# EasyEDA Pro project ESP32_Wroom.eprj, board PCB1
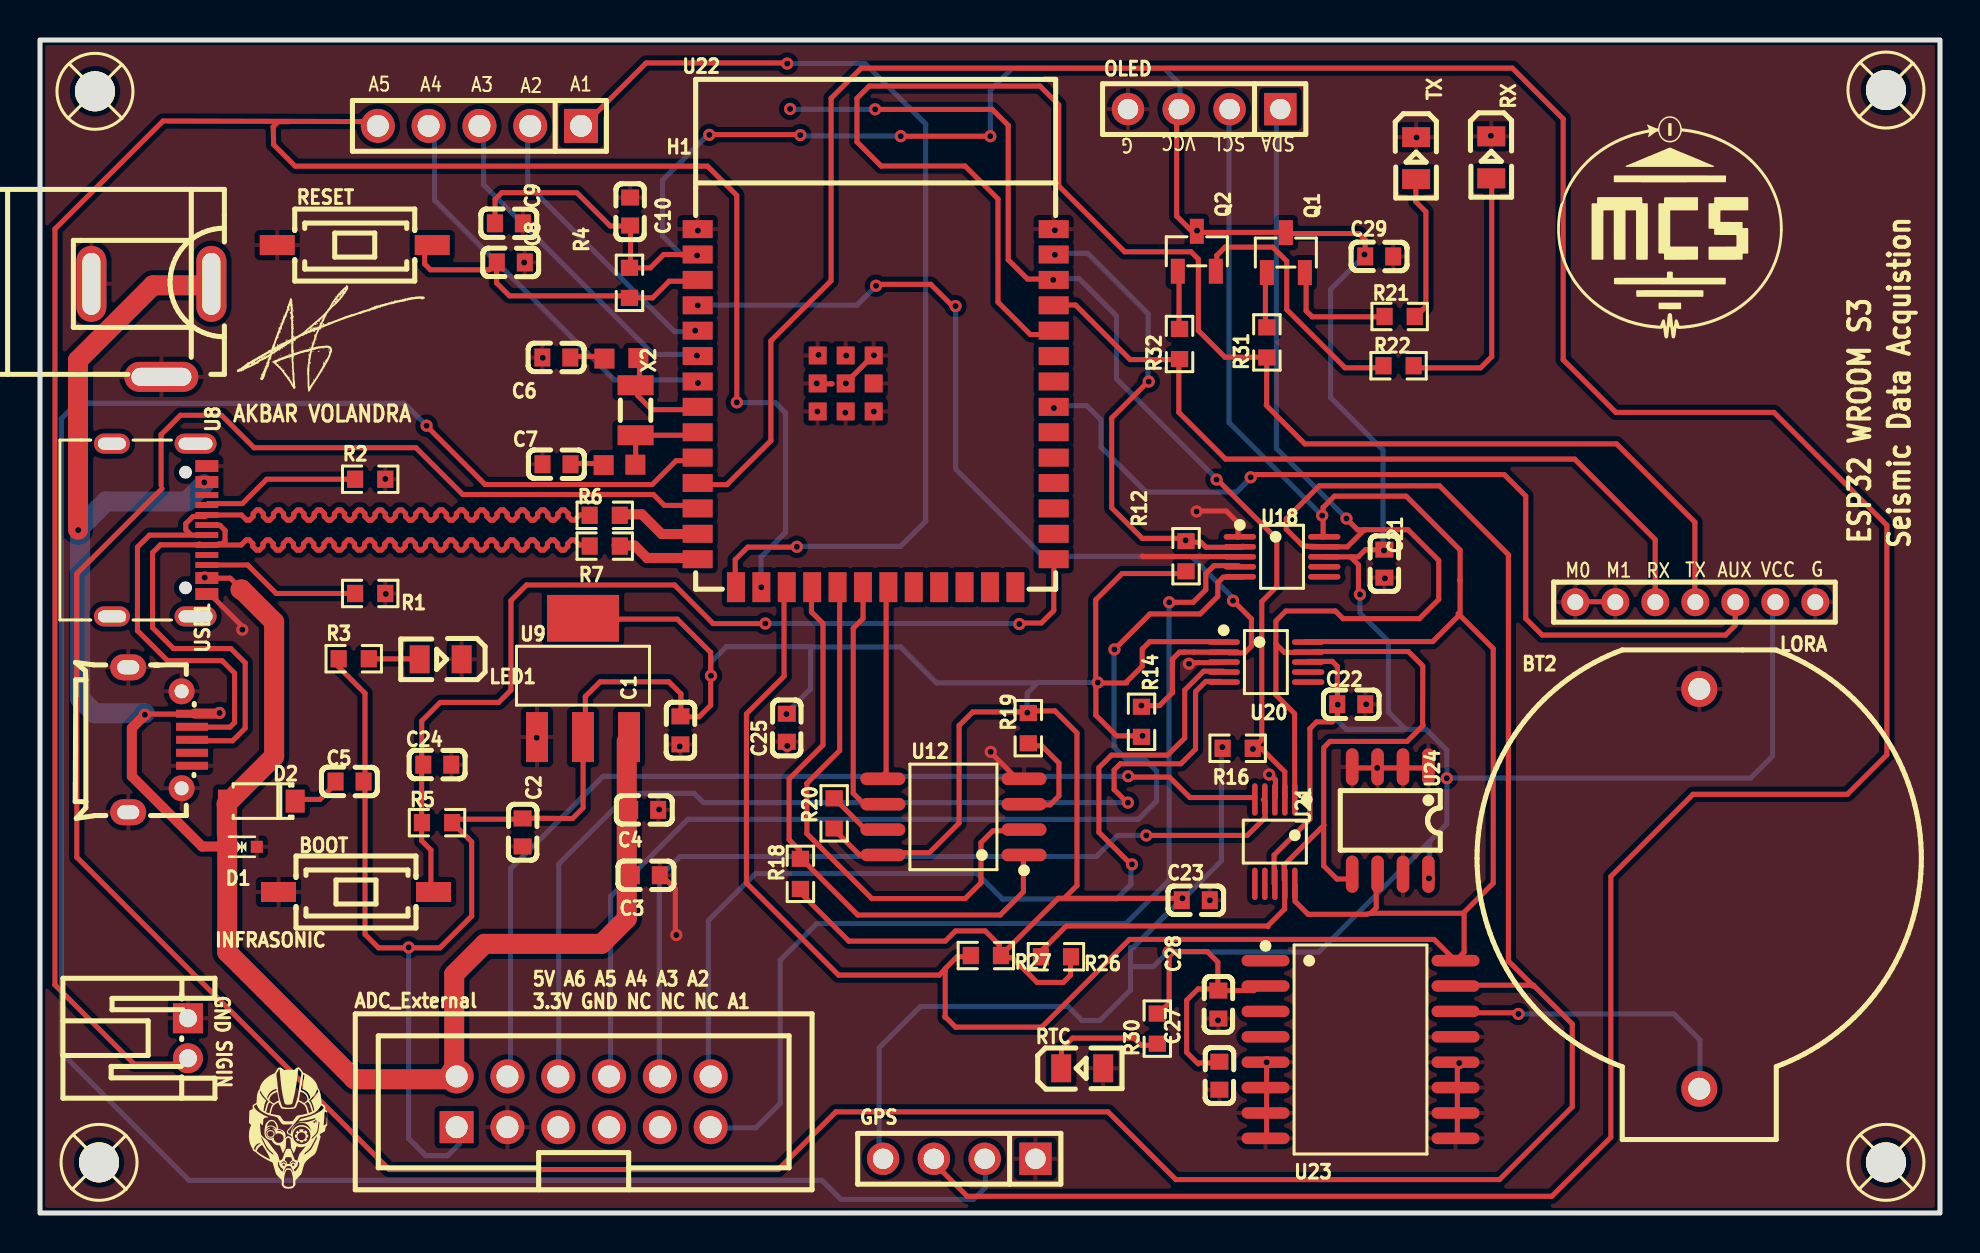
[diagram p3: board, top side]
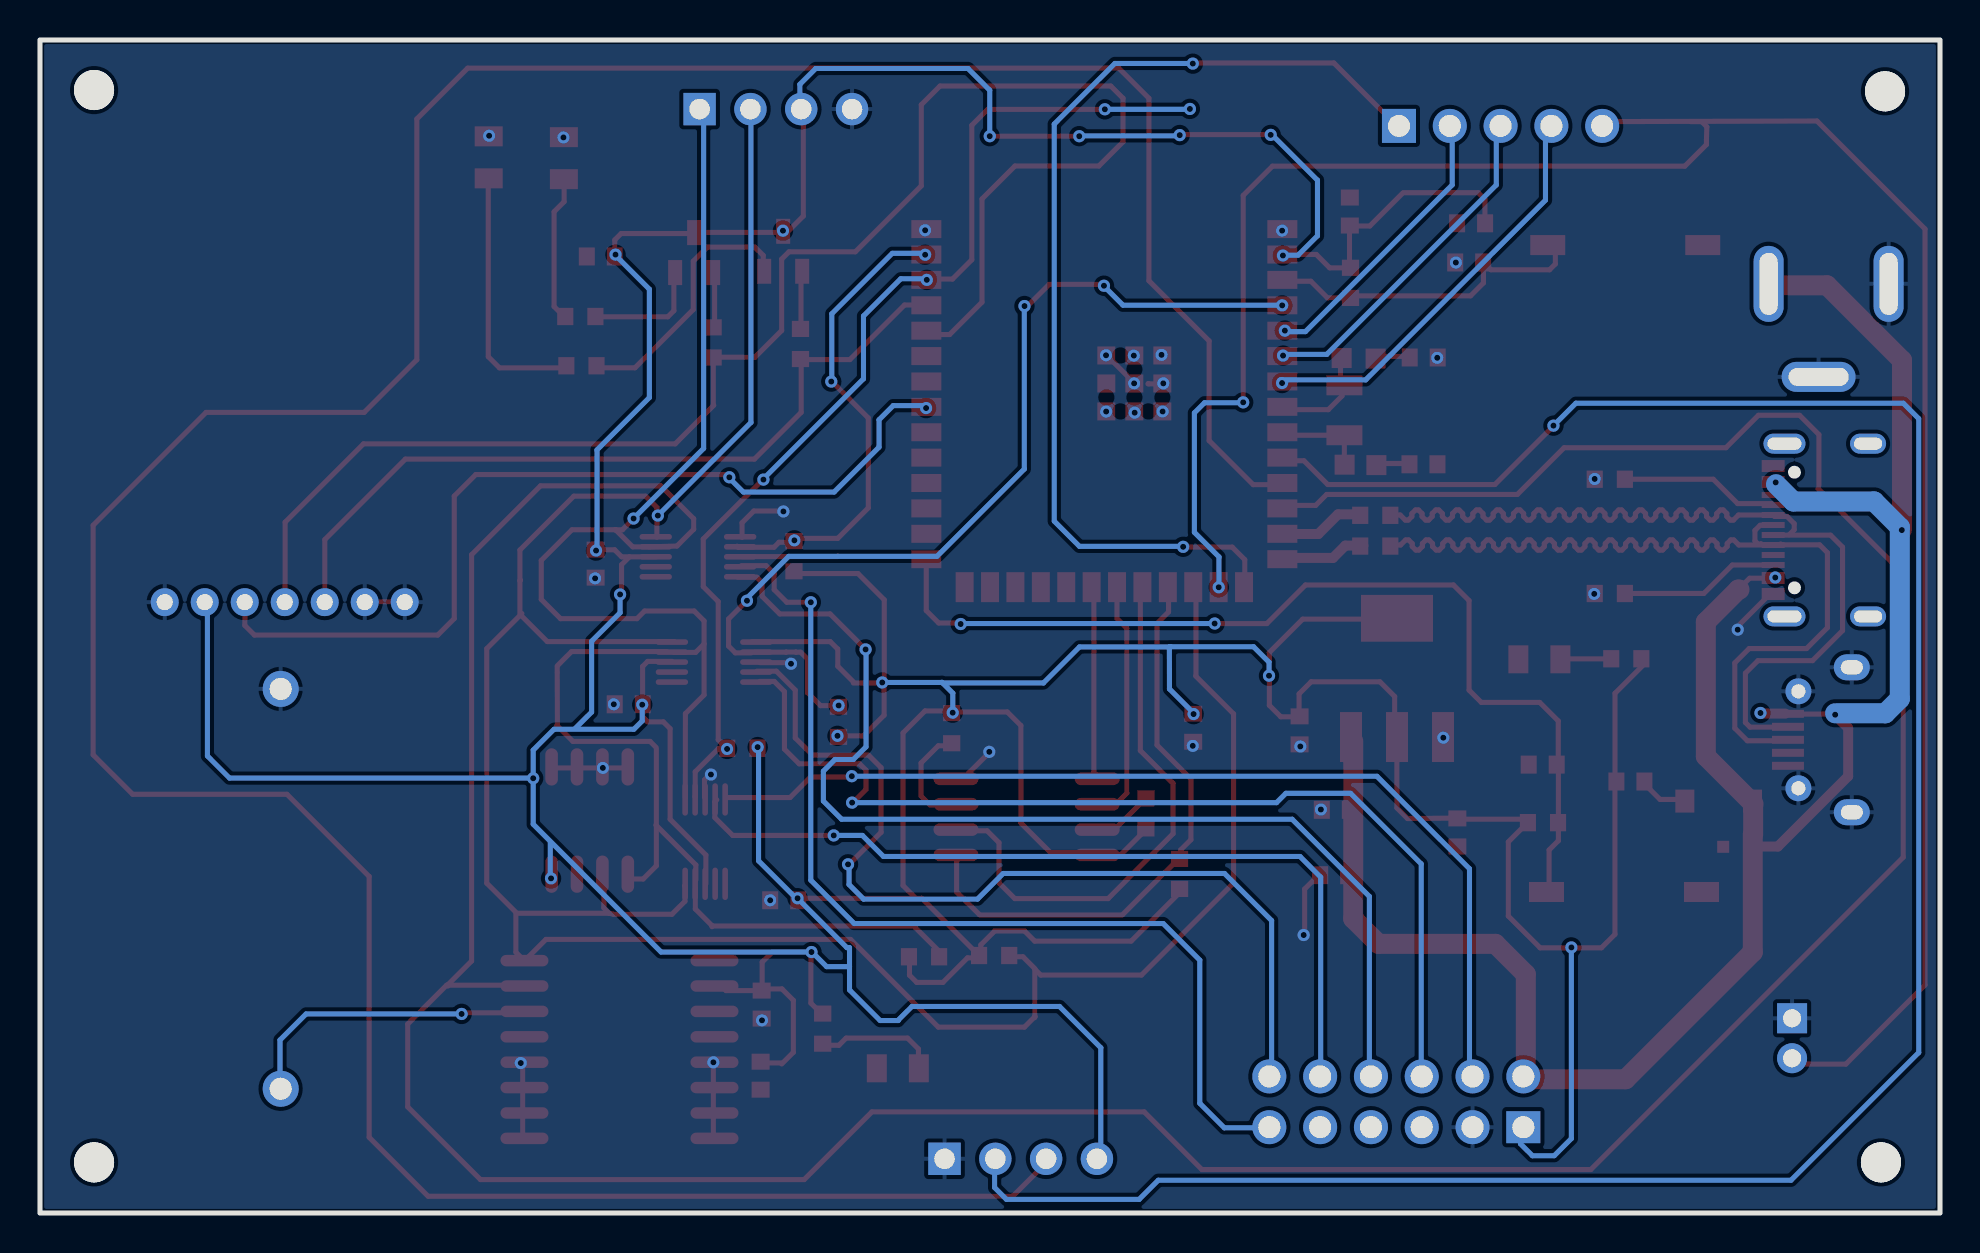
[diagram p4: board, bottom side, seen from below]

Outline 95 x 58.67 mm; copper layers: Top Layer, Bottom Layer. Coordinates in mm from the lower left corner of the outline.
Outline path: rectangle 0,58.67 95,0
Stack: Top Layer 0.035mm / Dielectric1 1.51mm FR4 er 4.5 / Bottom Layer 0.035mm

## Design rules (mm)
net D-: DP1
net D+: DP1
template: JLCPCB Capability(Two Layers Board)
spacing copperThickness1oz (default): track to track 0.102, other pairs 0.152 to 0.3
spacing copperThickness2oz: track to track 0.203, other pairs 0.152 to 0.3
track width copperThickness1oz (default): min 0.127, default 0.254, max 2.54
track width copperThickness2oz: min 0.203, default 0.254, max 2.54
differential pair differentialPair (default): width min 0.127, default 0.254, max 2.54; gap min 0.152, default 0.152
via viaSize (default): diameter min 0.5, default 0.61, max 10; hole min 0.3, default 0.305, max 6.3

## Placement (name value [footprint] x y rotation side)
ADC_External  T821112A1R100CEU  [IDC-TH_12P-P2.54_BOOMELE-2X6P-2.54MM]  27.18 5.56 0 top
BOOT  HX-3x6x2.5-X SMD tact Switch  [SW-SMD_HX-3X6X2.5-X]  15.8 16.06 0 top
BT2  XDBS-CR2032-9  [BAT-TH_XDBS-CR2032-9]  82.97 16.21 270 top
C1  10uF  [C0603]  32.02 24.14 270 top
C2  100nF  [C0603]  24.13 19.04 270 top
C3  10uF  [C0603]  30.29 16.9 180 top
C4  100nF  [C0603]  30.21 20.17 180 top
C5  10uF  [C0603]  15.48 21.58 0 top
C6  12pF  [C0603]  25.81 42.79 0 top
C7  12pF  [C0603]  25.83 37.45 0 top
C8  100nF  [C0603]  23.54 47.55 0 top
C9  22uF  [C0603]  23.45 49.5 0 top
C10  100nF  [C0603]  29.51 50.09 90 top
C21  1uF  [C0603]  67.22 32.48 270 top
C22  1uF  [C0603]  65.56 25.45 0 top
C23  1uF  [C0603]  57.79 15.64 0 top
C24  100nF  [C0603]  19.87 22.43 0 top
C25  100nF  [C0603]  37.34 24.27 90 top
C27  100nF  [C0603]  58.97 6.87 270 top
C28  100nF  [C0603]  58.92 10.43 270 top
C29  100nF  [C0603]  66.96 47.85 0 top
D1  LESD5D5.0CT1G  [SOD-523_L1.2-W0.8-LS1.6-BI]  10.09 18.32 0 top
D2  MBR0560  [SOD-123_L2.8-W1.8-LS3.7-RD]  11.07 20.6 180 top
GPS  HX PH254-01-04-Z-L11.5 straight pin header  [HDR-TH_4P-HX-PH254-01-04-Z-L11.5]  45.96 2.71 180 top
H1  2.54-1*5  [HDR-TH_5P-P2.54-V-M]  21.97 54.38 180 top
INFRASONIC  S2B-PH-K(LF)(SN)  [CONN-TH_S2B-PH-K-LF-SN]  7.4 8.74 90 top
LED1  KT-0805G  [LED0805-R-RD]  20.03 27.69 180 top
LORA  KH-2PH180-1X7P-L8.7  [CONN-TH_KH-2PH180-1X7P-L8.7]  82.76 30.55 0 top
NOREF  -  [Pad_e227]  28.18 37.41 0 top
NOREF#2  -  [Pad_e226]  29.92 42.76 0 top
NOREF#3  -  [Pad_e224]  28.22 42.74 0 top
NOREF#4  -  [Pad_e228]  29.77 37.43 0 top
OLED  HX PH254-01-04-Z-L11.5 straight pin header  [HDR-TH_4P-HX-PH254-01-04-Z-L11.5]  58.21 55.22 180 top
Q1  SS8050  [SOT-23-3_L2.9-W1.3-P1.90-LS2.4-BR]  62.29 48.04 270 top
Q2  SS8050  [SOT-23-3_L2.9-W1.3-P1.90-LS2.4-BR]  57.84 48.11 270 top
R1  5k1  [R0603]  16.51 30.99 180 top
R2  5k1  [R0603]  16.51 36.7 0 top
R3  330  [R0603]  15.69 27.72 0 top
R4  10K  [R0603]  29.47 46.53 270 top
R5  10K  [R0603]  19.85 19.52 0 top
R6  22  [R0603]  28.24 34.9 180 top
R7  22  [R0603]  28.24 33.36 180 top
R12  10K  [R0603]  57.3 32.85 270 top
R14  10K  [R0603]  55.08 24.57 270 top
R16  10K  [R0603]  59.88 23.25 180 top
R18  10K  [R0603]  38.02 16.96 90 top
R19  10K  [R0603]  49.42 24.25 270 top
R20  10K  [R0603]  39.71 19.99 270 top
R21  330  [R0603]  67.98 44.84 0 top
R22  330  [R0603]  67.93 42.38 0 top
R26  4.7K  [R0603]  50.8 12.82 180 top
R27  4.7K  [R0603]  47.29 12.88 180 top
R30  1k  [R0603]  55.87 9.22 90 top
R31  2.2k  [R0603]  61.34 43.55 90 top
R32  2.2k  [R0603]  56.98 43.47 90 top
RESET  HX-3x6x2.5-X SMD tact Switch  [SW-SMD_HX-3X6X2.5-X]  15.74 48.42 0 top
RTC  KT-0805G  [LED0805-R-RD]  52.11 7.24 0 top
RX  KT-0805G  [LED0805-R-RD]  72.56 52.8 270 top
SCREW1  -  [Screw-Hole-M2]  2.75 56.11 0 top
SCREW2  -  [Screw-Hole-M2]  92.3 56.17 0 top
SCREW3  -  [Screw-Hole-M2]  92.3 2.53 0 top
SCREW4  -  [Screw-Hole-M2]  2.95 2.53 0 top
TX  KT-0805G  [LED0805-R-RD]  68.81 52.76 270 top
U8  TYPE C-ZL-104PWB  [TYPE-C-SMD_HDGC_TYPE-C-ZL-104PWB]  5.97 34.16 270 top
U9  AMS1117-3.3  [SOT-223-3_L6.5-W3.4-P2.30-LS7.0-BR]  27.15 26.78 270 top
U12  W25Q128JVSIQ  [SOIC-8_L5.3-W5.3-P1.27-LS8.0-BL]  45.67 19.81 90 top
U18  ADS1115IDGSR  [MSOP-10_L3.0-W3.0-P0.50-LS5.0-BL]  62.1 32.82 270 top
U19  POWER-JACK  [DC-IN-TH_POWER-JACK]  5.57 44.15 0 top
U20  ADS1115IDGSR  [MSOP-10_L3.0-W3.0-P0.50-LS5.0-BL]  61.29 27.56 270 top
U21  ADS1115IDGSR  [MSOP-10_L3.0-W3.0-P0.50-LS5.0-BL]  61.74 18.58 180 top
U22  2.4GHz  [WIFIM-SMD_ESP32-S3-WROOM-1-N8]  41.78 40.26 0 top
U23  DS3231  [SOIC-16_L10.3-W7.5-P1.27-LS10.3-BL]  66.03 8.18 270 top
U24  AT24C32CDR165  [SOP-8_L4.9-W3.9-P1.27-LS6.0-BL]  67.51 19.63 180 top
USB1  MicroXNJ  [MICRO-USB-SMD_MICROXNJ]  6.01 23.67 270 top
X2  32.768kHz  [FC-135R_L3.2-W1.5]  29.78 40.15 270 top

## Footprints (pads in the part's own frame, mm; a bottom-side part is the same pattern mirrored in y, then rotated)
BAT-TH_XDBS-CR2032-9
  round 1.8 hole 1.1: 1(10,0) 2(-10,0)
C0603
  rect 0.8x0.9 smd: 1(-0.7,0) 2(0.7,0)
CONN-TH_KH-2PH180-1X7P-L8.7
  round 1.4 hole 0.8: 1(-6,0) 2(-4,0) 3(-2,0) 4(0,0) 5(2,0) 6(4,0) 7(6,0)
CONN-TH_S2B-PH-K-LF-SN
  rect 1.5x1.5 hole 0.9: 1(1,0)
  round 1.5 hole 0.9: 2(-1,0)
DC-IN-TH_POWER-JACK
  oval 1.5x3.8 hole 0.9x3.1: 1(2.999,2.325) 2(-2.999,2.325)
  oval 3.7x1.5 hole 3x0.9: 3(0.5,-2.325)
FC-135R_L3.2-W1.5
  rect 1x1.8 smd: 1(-1.25,0) 2(1.25,0)
HDR-TH_4P-HX-PH254-01-04-Z-L11.5
  rect 1.62x1.62 hole 1.02: 1(-3.81,0)
  round 1.62 hole 1.02: 2(-1.27,0) 3(1.27,0) 4(3.81,0)
HDR-TH_5P-P2.54-V-M
  rect 1.7x1.7 hole 1.1: 1(-5.08,0)
  round 1.7 hole 1.1: 2(-2.54,0) 3(0,0) 4(2.54,0) 5(5.08,0)
IDC-TH_12P-P2.54_BOOMELE-2X6P-2.54MM
  rect 1.7x1.6 hole 1.1: 1(-6.35,-1.27)
  round 1.7 hole 1.1: 2(-6.35,1.27) 3(-3.81,-1.27) 4(-3.81,1.27) 5(-1.27,-1.27) 6(-1.27,1.27) 7(1.27,-1.27) 8(1.27,1.27) 9(3.81,-1.27) 10(3.81,1.27) 11(6.35,-1.27) 12(6.35,1.27)
LED0805-R-RD
  rect 1x1.399 smd: 1(1.05,0) 2(-1.05,0)
MICRO-USB-SMD_MICROXNJ
  rect 0.4x1.6 smd: 1(-1.3,1.597) 2(-0.65,1.597) 3(0,1.597) 4(0.65,1.597) 5(1.3,1.597)
  round 1.3 hole 0.7: 6(2.425,1.074) 9(-2.425,1.073)
  oval 1.3x1.8 hole 0.7x1.1: 7(3.625,-1.597) 8(-3.625,-1.597)
MSOP-10_L3.0-W3.0-P0.50-LS5.0-BL
  oval 0.28x1.62 smd: 1(-1,-2.11) 2(-0.5,-2.11) 3(0,-2.11) 4(0.5,-2.11) 5(1,-2.11) 6(1,2.11) 7(0.5,2.11) 8(0,2.11) 9(-0.5,2.11) 10(-1,2.11)
Pad_e224
  rect 1x1 smd: 1(0,0)
Pad_e226
  rect 1x1 smd: 1(0,0)
Pad_e227
  rect 1x1 smd: 1(0,0)
Pad_e228
  rect 1x1 smd: 1(0,0)
R0603
  rect 0.806x0.864 smd: 1(-0.753,0) 2(0.753,0)
Screw-Hole-M2
  round 2 hole 2: 1(0,0)
SOD-123_L2.8-W1.8-LS3.7-RD
  rect 0.95x1.15 smd: 1(-1.692,0) 2(1.692,0)
SOD-523_L1.2-W0.8-LS1.6-BI
  rect 0.6x0.6 smd: 1(-0.75,0) 2(0.75,0)
SOIC-8_L5.3-W5.3-P1.27-LS8.0-BL
  oval 0.63x2.25 smd: 1(-1.905,-3.53) 2(-0.635,-3.53) 3(0.635,-3.53) 4(1.905,-3.53) 5(1.905,3.53) 6(0.635,3.53) 7(-0.635,3.53) 8(-1.905,3.53)
SOIC-16_L10.3-W7.5-P1.27-LS10.3-BL
  oval 0.574x2.401 smd: 1(-4.445,-4.75) 2(-3.175,-4.75) 3(-1.905,-4.75) 4(-0.635,-4.75) 5(0.635,-4.75) 6(1.905,-4.75) 7(3.175,-4.75) 8(4.445,-4.75) 9(4.445,4.75) 10(3.175,4.75) 11(1.905,4.75) 12(0.635,4.75) 13(-0.635,4.75) 14(-1.905,4.75) 15(-3.175,4.75) 16(-4.445,4.75)
SOP-8_L4.9-W3.9-P1.27-LS6.0-BL
  oval 0.63x1.865 smd: 1(-1.905,-2.683) 2(-0.635,-2.683) 3(0.635,-2.683) 4(1.905,-2.683) 5(1.905,2.683) 6(0.635,2.683) 7(-0.635,2.683) 8(-1.905,2.683)
SOT-23-3_L2.9-W1.3-P1.90-LS2.4-BR
  rect 1.25x0.7 smd: 1(1,-0.95) 2(1,0.95) 3(-1,0)
SOT-223-3_L6.5-W3.4-P2.30-LS7.0-BR
  rect 2.5x1.1 smd: 1(2.97,-2.3) 2(2.97,0) 3(2.97,2.3)
  rect 2.34x3.6 smd: 4(-2.97,0)
SW-SMD_HX-3X6X2.5-X
  rect 1.75x1 smd: 1(-3.875,0) 2(3.875,0)
TYPE-C-SMD_HDGC_TYPE-C-ZL-104PWB
  oval 1x2.1 hole 0.6x1.7: 12(-4.32,1.808) 13(4.32,1.808)
  oval 1x1.8 hole 0.6x1.4: 14(-4.32,-2.373) 15(4.32,-2.373)
  rect 0.6x1.15 smd: A1B12(-3.2,2.373) A4B9(-2.4,2.373) A9B4(2.4,2.373) A12B1(3.2,2.373)
  rect 0.3x1.15 smd: A5(-1.25,2.373) A6(-0.25,2.373) A7(0.25,2.373) A8(1.25,2.373) B5(1.75,2.373) B6(0.75,2.373) B7(-0.75,2.373) B8(-1.75,2.373)
WIFIM-SMD_ESP32-S3-WROOM-1-N8
  rect 1.5x0.9 smd: 1(-8.9,8.954) 2(-8.9,7.684) 3(-8.9,6.415) 4(-8.9,5.144) 5(-8.9,3.874) 6(-8.9,2.604) 7(-8.9,1.335) 8(-8.9,0.065) 9(-8.9,-1.206) 10(-8.9,-2.475) 11(-8.9,-3.745) 12(-8.9,-5.016) 13(-8.9,-6.285) 14(-8.9,-7.556) 27(8.9,-7.556) 28(8.9,-6.285) 29(8.9,-5.016) 30(8.9,-3.745) 31(8.9,-2.475) 32(8.9,-1.206) 33(8.9,0.065) 34(8.9,1.335) 35(8.9,2.604) 36(8.9,3.874) 37(8.9,5.144) 38(8.9,6.415) 39(8.9,7.684) 40(8.9,8.954)
  rect 0.9x1.5 smd: 15(-6.985,-8.954) 16(-5.715,-8.954) 17(-4.445,-8.954) 18(-3.175,-8.954) 19(-1.905,-8.954) 20(-0.635,-8.954) 21(0.635,-8.954) 22(1.905,-8.954) 23(3.175,-8.954) 24(4.445,-8.954) 25(5.715,-8.954) 26(6.985,-8.954)
  rect 0.9x0.9 smd: 41(-2.9,2.635) 41(-2.9,1.235) 41(-2.9,-0.165) 41(-1.5,2.635) 41(-1.5,1.235) 41(-1.5,-0.165) 41(-0.1,2.635) 41(-0.1,1.235) 41(-0.1,-0.165)

## Nets
As in the schematic, except:
RX: LORA.4 R31.1 U22.36
TX: LORA.3 R32.1 U22.37
XTALN: C7.2 NOREF.1 NOREF#4.1 U22.9 X2.2
XTALP: C6.2 NOREF#2.1 NOREF#3.1 U22.8 X2.1

Pads without a net: ADC_External 5 7 9; SCREW1 1; SCREW2 1; SCREW3 1; SCREW4 1; U8 12 13 14 15 A8 B8; U18 6 7; U20 6 7; U21 6 7; U22 22 23 24 25 26 32; U23 1 3 4; USB1 4

## Via types
v1: diameter 0.61, hole 0.305, Top Layer to Bottom Layer, 93 vias

## Routing (per net, layer and track width the routed paths; a pad name or vN(x,y) marks a point on that pad's centre or on a via; arc(x,y) is an arc through that point)
3.3V: length 384.2
  Top Layer w0.254: 52.92,26.51 54.33,26.51 ; 29.5,49.37 28.51,49.37 26.86,51.02 ; 59.39,28.58 55.49,28.58 55.12,28.21 ; 42.06,18.02 44.47,18.02 45.96,19.51 45.96,24.38 46.63,25.06 49.39,25.06 ; 20.78,19.37 21.58,18.56 21.58,14.85 20,13.26 18.46,13.26 ; 47.96,12.68 47.96,13.41 47.26,14.11 45.77,14.11 45.26,13.6 40.44,13.6 38.12,15.92 ; 16.25,21.31 16.25,13.94 16.93,13.26 18.46,13.26 ; 58.89,11.08 58.89,11.12 ; 58.89,11.12 58.87,11.12 ; 58.89,11.12 60.7,11.12 60.97,11.39 ; 32.6,47.95 31.19,47.95 30.52,47.28 29.61,47.28 29.59,47.25 ; 56.38,13.08 58.36,13.08 58.89,12.55 58.89,11.21 ; 32.03,24.82 32.96,24.82 33.53,25.39 33.53,26.55 ; 65.92,31.02 65.92,32.43 65.53,32.82 65.91,32.82 66.27,33.17 67.28,33.17 ; 48.04,12.87 50.91,15.74 57.05,15.74 ; 55.88,9.92 56.46,10.5 56.46,12.97 ; 27.27,24.33 27.27,25.83 28,26.57 31.44,26.57 32.05,25.97 32.05,24.88 ; 29.53,49.37 29.53,47.46 ; 24.14,19.73 24.11,19.7 ; 52.79,26.64 52.79,30.67 54.1,31.99 57.32,31.99 ; 41.87,17.91 40.98,17.91 39.83,19.06 ; 56.83,55.11 56.83,49.87 57.65,49.05 62.23,49.05 ; 33.53,26.87 33.53,28.04 31.87,29.7 27.29,29.7 ; 47.68,53.82 47.64,53.86 43.12,53.86 ; 63.4,27.59 64.62,27.59 64.87,27.34 64.87,24.82 64.62,24.57 63.83,24.57 63.49,24.23 63.49,19.69 61.71,17.91 61.71,16.47 ; 18.46,13.26 18.55,13.35 ; 51.21,15.75 51.85,16.38 51.85,24.01 50.75,25.11 49.47,25.11 ; 66.26,47.96 66.26,48.67 65.94,48.99 62.28,48.99 ; 16.25,21.62 16.25,26 14.74,27.5 ; 58.87,11.21 57.9,11.21 57.33,10.64 57.33,8.04 57.91,7.45 ; 54.98,23.87 53.82,23.87 52.79,24.9 52.79,26.38 ; 51.53,12.76 51.53,11.9 51.16,11.53 49.85,11.53 48.63,12.76 47.99,12.76 ; 33.39,53.94 38,53.94 38.01,53.93 ; 24.03,19.7 20.66,19.7 20.49,19.53 ; 26.82,51.04 23.09,51.04 22.75,50.7 22.75,49.4 ; 64.2,32.82 65.52,32.82 ; 54.33,26.57 55.11,27.35 55.11,28.22 ; 24.14,19.75 26.62,19.73 27.16,20.26 27.16,23.89 ; 58.97,7.51 57.91,7.51
  Bottom Layer w0.254: 47.35,53.9 47.51,54.07 47.51,56.16 48.6,57.25 56.21,57.25 57.01,56.45 57.01,55.28 ; 59.07,23.21 59.07,17.62 57.16,15.71 ; 49.87,26.51 49.36,26 49.36,25.07 ; 49.87,26.51 44.83,26.51 43.03,28.31 38.53,28.31 ; 49.87,26.51 49.89,26.54 ; 54.52,12.32 55.67,12.32 56.35,13 ; 54.52,12.32 54.52,13.27 54.65,13.27 v1(57.12,15.74) ; 54.52,12.32 54.52,11.16 52.99,9.63 52.09,9.63 52.09,9.64 51.4,10.33 44.03,10.33 41.96,8.27 41.96,2.97 ; 38.47,28.32 38.52,28.32 38.53,28.31 ; 38.47,28.32 34.32,28.32 33.55,27.55 33.55,26.95 ; 38.47,28.32 38.48,28.31 38.53,28.31 ; 49.89,26.54 49.9,26.55 ; 49.89,26.54 v1(52.89,26.54) ; 38.53,28.31 38.53,26.22 38.53,26.21 37.26,24.94 ; 38.01,53.88 42.97,53.88 43,53.9 ; 33.38,53.91 31.13,51.66 31.13,48.88 32.09,47.91 32.78,47.91 ; 69.49,18.54 69.49,16.79 69.5,16.77 ; v1(66,30.94) 66,30.02 67.42,28.6 67.42,25.05 68.23,24.24 ; 86.63,30.31 86.63,22.86 85.52,21.75 70.44,21.75 70.43,21.76 ; v1(64.89,25.43) 64.89,24.61 65.31,24.2 69.3,24.2 70.34,23.15 v1(70.34,21.75) 70.34,19.45 63.94,13.05 v1(56.43,13.05) ; 66.24,47.92 64.53,46.21 64.53,40.79 67.15,38.17 67.15,33.13 ; 20.8,4.31 20.98,4.13 20.98,3.46 20.38,2.87 19.29,2.87 18.43,3.72 v1(18.43,13.28)
  vias: v1(32.85,47.89) v1(33.47,53.93) v1(33.55,26.88) v1(37.32,24.96) v1(38.01,53.92) v1(43.04,53.86) v1(47.51,53.86) v1(49.37,25.03) v1(55.13,23.87) v1(57.85,49.14) v1(59.12,23.3) v1(66.22,47.94) v1(67.2,33.13) v1(69.45,16.74)
GND: length 35
  Top Layer w0.254: 40.25,41.53 40.44,41.71 40.48,41.71 41.49,42.73 41.56,42.73 ; 59,27.53 57.45,27.53 ; 61.54,21.9 61.77,21.66 61.77,20.79 ; 69.33,22.3 69.29,22.26 v1(66.86,22.26) 65.6,22.26 ; 70.84,3.74 70.87,3.76 70.87,7.51 ; 49.2,21.7 48.87,21.7 47.5,23.07 ; 55.11,32.87 55.15,32.83 59.9,32.83 ; 57.72,35.14 57.75,35.11 59.31,35.11 59.9,34.53 59.9,33.79 ; 39.56,41.47 39.58,41.49 ; 10.23,29.14 10.23,29.23 8.4,31.05 ; 78.65,30.52 78.6,30.57 76.81,30.57 ; 30.78,16.7 31.28,16.7 31.77,16.21 31.77,13.99 ; 38.83,41.47 39.6,41.47 ; 61.22,3.68 61.33,3.79 v1(61.33,7.54)
  vias: v1(10.11,29.18) v1(17.27,36.72) v1(17.29,30.97) v1(24.21,47.54) v1(24.83,23.77) v1(25.14,42.78) v1(30.96,20.18) v1(31.82,13.91) v1(31.98,23.34) v1(32.89,49.14) v1(37.36,23.37) v1(38.84,41.5) v1(38.87,40.09) v1(38.92,42.92) v1(40.27,40.03) v1(40.31,42.89) v1(40.29,41.5) v1(41.7,42.9) v1(41.69,40.09) v1(47.54,23.07) v1(50.74,49.16) v1(57.45,27.47) v1(57.83,35.09) v1(58.49,15.64) v1(58.9,9.64) v1(61.45,21.93) v1(66.31,25.45) v1(67.25,31.75) v1(68.83,53.8) v1(70.96,7.5) v1(72.54,53.88)
VBUS: length 108.2
  Top Layer w0.254: 8.15,31.75 9.5,31.75 ; 9.52,31.75 10.09,31.18 ; 9.42,18.86 9.46,18.82 ; 7.46,24.95 5.26,24.95
  Top Layer w0.5: 8.97,24.99 8.96,24.98 7.73,24.98 ; 5.22,24.89 4.59,24.26 4.59,21.84 8.11,18.33 9.05,18.33
  Top Layer w1: 8.71,46.4 5.65,46.4 1.9,42.65 1.9,34.18 ; 20.64,6.84 20.5,6.69 15.72,6.69 9.36,13.05 9.36,18.94 ; 20.71,6.97 20.71,11.94 22.23,13.46 28.08,13.46 29.34,14.72 29.34,23.6 ; 9.32,20.46 11.71,22.84 11.71,29.56 10.09,31.18 10.03,31.18 ; 9.34,20.31 9.34,18.94
  Bottom Layer w1: 5.24,25 2.73,25 2.01,25.72 2.01,34.31 3.29,35.59 7.33,35.59 8.2,36.46
  vias: v1(1.91,34.16) v1(5.24,24.92) v1(8.22,36.54) v1(8.24,31.79) v1(8.98,25.01)
A1: length 50.9
  Top Layer w0.254: 59.93,32.38 58.69,32.38 58.29,31.98 58.29,31.18 57.66,30.55 v1(56.46,30.55)
  Bottom Layer w0.254: v1(56.46,30.55) 56.46,16.65 54.29,14.48 38.84,14.48 37.01,12.65 37.01,5.49 35.78,4.26 33.53,4.26
A2: length 55.6
  Top Layer w0.254: v1(53.72,28.19) 55.5,29.96 58.01,29.96 58.89,30.84 58.89,31.53 59.16,31.8 60.11,31.8
  Bottom Layer w0.254: 28.49,6.84 28.53,6.88 28.53,15.83 32.39,19.7 54.92,19.7 55.83,20.61 55.83,22.1 55.25,22.69 54.33,22.69 53.7,23.32 53.7,28.2
A3: length 46.9
  Top Layer w0.254: 54.56,17.42 52.95,19.04 52.95,22.28 53.57,22.9 56.35,22.9 ; 56.36,22.89 57.24,23.76 57.24,26.16 58.18,27.1 59.15,27.1
  Bottom Layer w0.254: 54.55,17.5 54.55,16.43 53.82,15.7 48.12,15.7 46.84,16.98 35.77,16.98 33.42,14.63 33.42,7.14 33.21,6.92
  vias: v1(54.6,17.44)
A4: length 51.7
  Top Layer w0.254: 59.01,26.59 58.29,26.59 57.78,26.08 57.78,23.2 57.04,22.47 54.02,22.47 53.7,22.16 53.7,21.19 54.37,20.52
  Bottom Layer w0.254: 54.46,20.53 33.17,20.53 32.71,20.99 29.47,20.99 25.94,17.46 25.94,6.82 25.85,6.73
  vias: v1(54.4,20.53)
A5: length 42.1
  Top Layer w0.254: v1(55.31,18.89) 60.37,18.89 61.26,19.78 61.26,20.57 61.16,20.67
  Bottom Layer w0.254: v1(55.31,18.89) 53.88,18.89 52.83,17.83 32,17.83 30.97,16.8 30.97,7.32 30.85,7.21
A6: length 50
  Top Layer w0.254: 54.28,21.8 56.47,21.8 57.49,20.78 60.71,20.78
  Bottom Layer w0.254: 23.53,6.93 23.53,17.22 28.15,21.84 54.37,21.84 54.46,21.76
  vias: v1(54.41,21.85)
ADC1_2: length 51.1
  Top Layer w0.254: 34.76,31.55 34.76,32.68 35.39,33.31 37.87,33.31 ; 27.03,54.25 30.31,57.52 37.33,57.52
  Bottom Layer w0.254: 37.44,57.5 41.26,57.5 44.29,54.47 44.29,34.61 43.03,33.35 37.8,33.35
  vias: v1(37.36,57.49) v1(37.84,33.32)
ADC1_4: length 14.4
  Bottom Layer w0.254: 24.39,54.31 24.39,51.42 31.73,44.09 32.89,44.09
  vias: v1(32.76,44.14)
ADC1_5: length 17.1
  Bottom Layer w0.254: 22.19,54.22 22.19,51.42 30.66,42.95 33,42.95
  vias: v1(32.85,42.89)
ADC1_6: length 20.8
  Bottom Layer w0.254: 19.3,54.31 19.73,53.88 19.73,50.66 28.71,41.67 33,41.67
  vias: v1(32.9,41.51)
ADC1_8: length 113
  Top Layer w0.254: 34.8,40.57 34.84,40.61 34.84,50.9 33.38,52.36 12.76,52.36 11.68,53.44 11.68,53.69 11.66,54.33 11.92,54.59 12.45,54.59 ; 7.72,7.51 7.66,7.45 4.71,7.45 0.75,11.41 0.75,49.22 6.15,54.62 16.66,54.59 16.77,54.48
  Bottom Layer w0.254: 34.74,40.53 36.77,40.53 37.28,40.02 37.28,34.05 36.05,32.82 36.05,31.38
  vias: v1(34.84,40.55) v1(36.06,31.3)
D+: length 53.1
  Top Layer w0.254: 27.61,33.46 27.57,33.41 26.97,33.41 26.72,33.67 26.57,33.67 26.39,33.49 26.39,33.34 26.21,33.16 26.06,33.16 25.88,33.34 25.88,33.49 25.7,33.67 25.55,33.67 25.37,33.49 25.37,33.34 25.19,33.16 25.04,33.16 24.87,33.34 24.87,33.49 24.69,33.67 24.54,33.67 24.36,33.49 24.36,33.34 24.18,33.16 24.03,33.16 23.85,33.34 23.85,33.49 23.67,33.67 23.52,33.67 23.34,33.49 23.34,33.34 23.16,33.16 23.01,33.16 22.83,33.34 22.83,33.49 22.65,33.67 22.5,33.67 22.33,33.49 22.33,33.34 22.15,33.16 22,33.16 21.82,33.34 21.82,33.49 21.64,33.67 21.49,33.67 21.31,33.49 21.31,33.34 21.13,33.16 20.98,33.16 20.8,33.34 20.8,33.49 20.62,33.67 20.47,33.67 20.29,33.49 20.29,33.34 20.11,33.16 19.96,33.16 19.79,33.34 19.79,33.49 19.61,33.67 19.46,33.67 19.28,33.49 19.28,33.34 19.1,33.16 18.95,33.16 18.77,33.34 18.77,33.49 18.59,33.67 18.44,33.67 18.26,33.49 18.26,33.34 18.08,33.16 17.93,33.16 17.75,33.34 17.75,33.49 17.57,33.67 17.42,33.67 17.25,33.49 17.25,33.34 17.07,33.16 16.92,33.16 16.74,33.34 16.74,33.49 16.56,33.67 16.41,33.67 16.23,33.49 16.23,33.34 16.05,33.16 15.9,33.16 15.72,33.34 15.72,33.49 15.54,33.67 15.39,33.67 15.21,33.49 15.21,33.34 15.03,33.16 14.88,33.16 14.7,33.34 14.7,33.49 14.53,33.67 14.38,33.67 14.2,33.49 14.2,33.34 14.02,33.16 13.87,33.16 13.69,33.34 13.69,33.49 13.51,33.67 13.36,33.67 13.18,33.49 13.18,33.34 13,33.16 12.85,33.16 12.67,33.34 12.67,33.49 12.49,33.67 12.34,33.67 12.17,33.49 12.17,33.34 11.99,33.16 11.84,33.16 11.66,33.34 11.66,33.49 11.48,33.67 11.33,33.67 11.15,33.49 11.15,33.34 10.97,33.16 10.82,33.16 10.64,33.34 10.64,33.49 10.46,33.67 10.31,33.67 10.06,33.41 U8.B6 ; 7.96,33.47 7.92,33.42 6.02,33.42 5.63,33.03 5.63,29.28 6.67,28.23 9.54,28.23 10.26,27.52 10.26,24.25 9.63,23.62 7.42,23.62 ; 8.35,34.4 8.99,34.4 9.25,34.14 9.25,33.62 9.08,33.44 8.99,33.44 8.95,33.48
  Top Layer w0.5: 28.83,33.38 29.73,33.38 30.35,32.77 32.72,32.77
D-: length 52.9
  Top Layer w0.254: 7.54,33.92 7.29,34.18 7.29,34.48 7.65,34.84 8.27,34.84 U8.B7 10.08,34.91 10.33,34.66 10.48,34.66 10.66,34.84 10.66,34.99 10.84,35.17 10.99,35.17 11.17,34.99 11.17,34.84 11.35,34.66 11.49,34.66 11.67,34.84 11.67,34.99 11.85,35.17 12,35.17 12.18,34.99 12.18,34.84 12.36,34.66 12.51,34.66 12.69,34.84 12.69,34.99 12.87,35.17 13.02,35.17 13.2,34.99 13.2,34.84 13.38,34.66 13.53,34.66 13.71,34.84 13.71,34.99 13.89,35.17 14.03,35.17 14.21,34.99 14.21,34.84 14.39,34.66 14.54,34.66 14.72,34.84 14.72,34.99 14.9,35.17 15.05,35.17 15.23,34.99 15.23,34.84 15.41,34.66 15.56,34.66 15.74,34.84 15.74,34.99 15.92,35.17 16.07,35.17 16.25,34.99 16.25,34.84 16.43,34.66 16.57,34.66 16.75,34.84 16.75,34.99 16.93,35.17 17.08,35.17 17.26,34.99 17.26,34.84 17.44,34.66 17.59,34.66 17.77,34.84 17.77,34.99 17.95,35.17 18.1,35.17 18.28,34.99 18.28,34.84 18.46,34.66 18.61,34.66 18.79,34.84 18.79,34.99 18.97,35.17 19.11,35.17 19.29,34.99 19.29,34.84 19.47,34.66 19.62,34.66 19.8,34.84 19.8,34.99 19.98,35.17 20.13,35.17 20.31,34.99 20.31,34.84 20.49,34.66 20.64,34.66 20.82,34.84 20.82,34.99 21,35.17 21.15,35.17 21.33,34.99 21.33,34.84 21.51,34.66 21.65,34.66 21.83,34.84 21.83,34.99 22.01,35.17 22.16,35.17 22.34,34.99 22.34,34.84 22.52,34.66 22.67,34.66 22.85,34.84 22.85,34.99 23.03,35.17 23.18,35.17 23.36,34.99 23.36,34.84 23.54,34.66 23.69,34.66 23.87,34.84 23.87,34.99 24.05,35.17 24.19,35.17 24.37,34.99 24.37,34.84 24.55,34.66 24.7,34.66 24.88,34.84 24.88,34.99 25.06,35.17 25.21,35.17 25.39,34.99 25.39,34.84 25.57,34.66 25.72,34.66 25.9,34.84 25.9,34.99 26.08,35.17 26.23,35.17 26.41,34.99 26.41,34.84 26.59,34.66 26.73,34.66 26.99,34.91 27.37,34.91 27.39,34.9 ; 31.76,33.96 31.78,33.95 ; 7.51,24.3 9.5,24.3 9.73,24.54 9.73,27 9.1,27.63 6.38,27.63 4.87,29.13 4.87,33.31 5.47,33.91 8.16,33.91 8.17,33.9
  Top Layer w0.5: 29,34.95 30.1,34.95 31.08,33.96 32.54,33.96 32.57,33.94
EN: length 16.1
  Top Layer w0.254: 22.83,47.41 22.83,46.52 23.47,45.88 29.41,45.88 ; 32.59,46.53 32.51,46.61 31.46,46.61 30.63,45.78 29.33,45.78 ; 22.86,47.44 22.88,47.47 ; 19.23,48.36 19.23,47.47 19.52,47.18 22.45,47.18 22.78,47.51
GP1: length 23.8
  Top Layer w0.254: 57.28,33.55 58.05,33.55 58.3,33.3 60.09,33.3 60.14,33.35 ; 55.49,41.67 53.59,39.77 53.59,35.27 55.11,33.75 57.15,33.75
  Bottom Layer w0.254: 50.6,47.89 50.72,48 52.38,48 55.41,44.98 55.41,41.62
  vias: v1(50.74,47.93) v1(55.44,41.59) v1(57.28,33.65)
GP2: length 53.3
  Top Layer w0.254: 60.69,23.28 61.09,23.67 61.09,30.58 61.84,31.33 61.84,33.71 58.87,36.68 ; 50.74,46.72 49.37,46.72 48.41,47.68 48.41,54.41 47.62,55.2 41.74,55.2 ; 60.7,23.22 61.09,23.22 62.24,22.07 62.24,20.84 62.25,20.83
  Bottom Layer w0.254: 58.88,36.67 53.83,41.72 53.83,44.87 51.96,46.73 50.66,46.73 ; 37.5,55.2 37.51,55.21 v1(41.76,55.21)
  vias: v1(37.51,55.22) v1(50.66,46.68) v1(58.83,36.68) v1(60.65,23.21)
GP4: length 48.8
  Top Layer w0.254: 41.81,46.45 44.54,46.45 45.69,45.3 ; 59.44,28.02 60.23,28.02 60.57,28.36 60.57,29.71 59.61,30.68 ; 54.98,25.38 55.97,25.38 56.62,26.03 56.62,27.7 56.97,28.05 57.2,28.05 57.21,28.06 57.69,28.06 57.7,28.05 59.26,28.05
  Bottom Layer w0.254: 59.71,30.7 57.56,32.84 50.15,32.84 45.78,37.21 45.78,45.35 ; 32.91,45.41 40.85,45.41 41.8,46.36
  vias: v1(32.89,45.4) v1(41.8,46.38) v1(45.78,45.37) v1(55.07,25.39) v1(59.65,30.63)
GP10: length 29.2
  Top Layer w0.254: 37.97,17.76 37.97,18.16 37.45,18.67 37.45,21.71 39.15,23.41 39.15,29.49 38.57,30.07 38.57,31.23 38.56,31.25 ; 49.17,17.96 49.17,16.06 48.01,14.91 40.89,14.91 38.12,17.68
GP11: length 27.8
  Top Layer w0.254: 49.14,19.12 47.64,19.12 47.05,18.52 47.05,16.52 46.26,15.73 41.59,15.73 38.34,18.98 38.34,21.49 39.98,23.13 39.98,31.06 39.77,31.27
GP12: length 12.1
  Top Layer w0.254: 41.09,31.1 41.15,31.04 41.15,29.74 40.66,29.25 40.66,21 41.19,20.47 42.23,20.47
GP13: length 9.6
  Top Layer w0.254: 41.94,21.68 42.31,22.04 42.31,31.12
GP17: length 116.9
  Top Layer w0.254: v1(19.33,39.38) 19.48,39.23 19.48,39.21 22.25,36.44 30.61,36.44 31.8,37.63 32.91,37.63
  Bottom Layer w0.254: 47.27,2.66 47.27,1.28 46.68,0.68 40.04,0.68 39.09,1.64 7.45,1.64 1.06,8.02 1.06,39.73 1.83,40.5 18.21,40.5 v1(19.33,39.38)
GP18: length 169.4
  Top Layer w0.254: 32.93,36.43 34.34,36.43 36.54,38.63 36.54,43.62 39.55,46.63 39.55,55.76 41.06,57.27 73.62,57.27 76.16,54.72 76.16,42.68 78.79,40.05 86.7,40.05 92.34,34.4 92.34,22.92 90.37,20.94 82.65,20.94 78.54,16.83 78.54,3.79 75.59,0.84 46.36,0.84 44.73,2.47
GP40: length 45.4
  Top Layer w0.254: 60.5,36.8 60.64,36.94 73.21,36.94 74.29,35.86 74.29,29.73 75.11,28.91 84.28,28.91 84.76,29.39 84.76,30.58
  Bottom Layer w0.254: 60.52,36.74 59.83,36.06 55.29,36.06 53.05,38.31 53.05,39.68 52.34,40.39 50.76,40.39 50.64,40.27
  vias: v1(50.69,40.26) v1(60.53,36.8)
RX: length 80.2
  Top Layer w0.254: 61.31,40.4 63.24,38.47 78.83,38.47 82.74,34.56 82.74,30.5 82.77,30.47 ; 50.59,43.94 49.52,43.94 47.9,45.56 47.9,50.72 46.25,52.37 42.06,52.37 40.85,53.58 40.85,55.76 41.46,56.37 50,56.37 50.94,55.43 50.94,51.38 54.23,48.08 57.55,48.08 57.92,47.71 57.92,44.14 59.25,42.81 61.44,42.81 ; 61.33,42.77 61.33,40.42
SCL: length 132.9
  Top Layer w0.254: 71,31.62 71,33.16 68.31,35.86 64.72,35.86 64.16,35.29 64.16,34.84 ; 71,31.62 71,29.99 ; 71,31.62 70.97,31.66 ; 63.28,28.58 69.64,28.58 70.97,29.92 ; 37.2,31.23 37.2,26.86 ; 70.97,29.92 72.66,28.23 72.66,16.5 71.16,14.99 66.54,14.99 ; 70.97,29.92 70.91,29.99 ; 66.54,14.99 66.81,15.26 66.81,16.9 ; 66.54,14.99 66.33,14.94 63.4,14.94 62.75,15.59 62.75,16.35 62.77,16.37 ; 64.16,33.8 64.16,34.84 ; 64.16,34.84 v1(64.11,34.88) ; 70.69,12.52 70.69,12.62 ; 45.26,9.81 45.24,9.83 ; 45.26,9.81 45.26,12.2 44.96,11.9 39.93,11.9 35.32,16.51 35.32,24.97 37.22,26.86 ; 45.26,9.81 45.26,9.77 ; 45.26,9.81 45.78,9.3 50.08,9.3 54.47,13.68 69.71,13.68 70.69,12.7 ; 45.25,12.22 45.85,12.82 46.38,12.82 ; 70.79,12.62 71.21,13.04 71.21,14.97
  Bottom Layer w0.254: 59.45,54.99 59.45,39.54 v1(64.11,34.88)
SDA: length 276.9
  Top Layer w0.254: 63.65,28.08 68.42,28.08 69.14,27.36 ; 32.89,35.39 31.22,35.39 30.67,35.94 21.13,35.94 18.8,38.28 10.7,38.28 9.08,39.9 7.02,39.9 6.05,38.94 6.05,36.4 ; 64.18,19.41 64.18,23.21 ; 61.4,14.32 61.4,14.36 ; 61.4,14.36 61.4,14.37 62.23,15.21 62.23,16.23 ; 61.4,14.36 51.31,14.36 49.91,12.96 ; 74.61,11.4 74.61,11.35 ; 74.61,11.4 74.61,11.41 73.42,12.6 73.42,32.93 69.98,36.37 63.96,36.37 62.32,34.73 62.32,34.2 63.15,33.36 64.51,33.32 65.37,33.32 66.22,34.17 ; 74.61,11.4 74.67,11.4 76.61,9.45 76.61,5.31 72.98,1.67 56.79,1.67 53.4,5.06 39.79,5.06 36.91,2.17 17.46,2.17 1.84,17.79 1.84,31.97 6.1,36.24 ; 74.61,11.4 70.72,11.4 ; 69.17,24.4 68.36,23.59 64.5,23.59 64.19,23.29 ; 66.22,34.17 66.22,34.18 68.4,34.18 69.94,32.64 69.94,30.69 68.97,29.73 65.15,29.73 64.77,30.11 62.29,30.11 61.8,29.62 61.8,28.46 ; 66.22,34.17 66.25,34.17 ; 66.22,34.17 65.88,34.17 65.21,34.84 ; 64.18,19.39 64.2,19.41 ; 64.18,19.39 62.21,17.41 62.21,16.67 ; 64.18,19.39 64.18,17.37 64.84,16.71 65.6,16.71 ; 69.14,27 69.13,24.44 ; 63.31,28.04 62.22,28.04 61.8,28.46 ; 61.79,25.92 62.73,24.98 62.74,20.78 ; 61.8,28.46 61.8,25.92 ; 69.14,27.06 69.14,27.3
  Bottom Layer w0.254: v1(65.32,34.74) 61.82,38.24 61.82,54.88
TX: length 39.6
  Top Layer w0.254: 80.68,30.53 80.76,30.61 80.76,33.68 76.73,37.71 59.28,37.71 56.94,40.05 56.94,42.63 ; 50.62,45.42 51.77,45.42 54.51,42.69 56.87,42.69
XTALN: length 6
  Top Layer w0.254: 29.78,38.88 29.78,37.48 29.8,37.47 ; 26.5,37.49 28.16,37.49 28.17,37.5 ; 32.87,38.92 32.86,38.9 30.01,38.9
XTALP: length 6.8
  Top Layer w0.254: 29.9,41.38 29.9,40.87 30.59,40.18 32.71,40.18 32.88,40.35 ; 26.6,42.83 26.62,42.85 28.21,42.85 ; 29.98,41.44 29.98,42.78
$1N3274: length 8
  Top Layer w0.254: R1.2 11.81,30.99 10.39,32.41 U8.B5
$1N3576: length 7.9
  Top Layer w0.254: R2.1 11.34,36.7 10.12,35.48 8.41,35.48 U8.A5
$1N3936: length 2.4
  Top Layer w0.254: 12.66,20.69 14,20.69 14.72,21.41
$1N4181: length 2.5
  Top Layer w0.254: 16.42,27.72 18.87,27.72
$1N5037: length 49
  Top Layer w0.254: 19.08,22.17 19.08,19.51 ; 19.08,19.51 19.12,19.55 ; 19.08,19.51 19.08,18.62 19.55,18.16 19.55,16.11 ; 50.67,32.85 50.69,32.83 50.69,30.13 50.07,29.51 49.01,29.51 ; 19.09,22.62 19.09,24.61 20.02,25.54 22.93,25.54 23.55,26.15 23.55,30.63 24.33,31.41 31.72,31.41 33.66,29.48 36.25,29.48
  Bottom Layer w0.254: v1(48.97,29.46) 48.94,29.49 36.32,29.49
  vias: v1(36.27,29.49)
$1N8957: length 5.2
  Top Layer w0.254: 49.4,23.37 50.09,23.37 50.95,22.51 50.95,20.86 50.5,20.41 49.5,20.41
$1N9100: length 2.9
  Top Layer w0.254: 42.12,19.12 41.34,19.12 39.83,20.63
$1N14321: length 2.9
  Top Layer w0.254: 61.27,47.06 61.27,44.28 61.34,44.2
$1N14407: length 5.9
  Top Layer w0.254: 63.31,47.02 63.31,45.13 63.61,44.83 67.21,44.83
$1N14412: length 7.1
  Top Layer w0.254: 68.79,51.57 68.79,50.58 69.3,50.08 69.3,45.34 68.83,44.88
$1N14569: length 2.9
  Top Layer w0.254: 56.95,47.03 56.95,44.17 56.99,44.13
$1N14578: length 13
  Top Layer w0.254: 68.63,42.27 72.03,42.27 72.59,42.83 72.59,51.5 72.5,51.59
$1N28262: length 6.1
  Top Layer w0.254: 55.71,8.36 55.69,8.39 55.05,8.39 54.69,8.75 51.62,8.75 51.08,8.2 51.08,7.09
$1N34936: length 13.3
  Top Layer w0.254: 67.26,42.28 65.25,42.28 62.34,45.19 62.34,47.61 61.64,48.31 59.25,48.31 58.84,47.9 58.84,47.08
$1N34953: length 15.2
  Top Layer w0.254: 70.83,10.01 73.89,10.01
  Bottom Layer w0.254: 82.91,6.15 83,6.24 83,8.65 81.69,9.96 v1(73.92,9.96)

## Copper pours and planes (outline as drawn; the poured copper is in the pictures)
GND on Top Layer: -5.7,63.55 100.97,63.55 100.97,-2.39 -5.7,-2.39
GND on Bottom Layer: -6.72,62.61 97.35,62.61 97.35,-5.81 -6.72,-5.81

## Text on the board
Top Silkscreen Layer: G | VCC | SCL | SDA | A5 | A4 | A3 | A2 | A1 | M0 | M1 | RX | TX | AUX | 5V A6 A5 A4 A3 A2 / 3.3V GND NC NC NC A1 | GND | SIGIN | AKBAR VOLANDRA | ESP32 WROOM S3 | Seismic Data Acquistion
